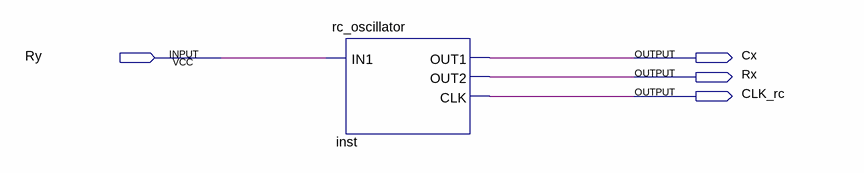
[diagram p0: schematic sheet]
// Quartus schematic RC.bdf as structural Verilog: 1 symbols, 4 pins
module RC (
  input  Ry,
  output Cx,
  output Rx,
  output CLK_rc
);

  rc_oscillator inst (.IN1(Ry), .OUT1(Cx), .OUT2(Rx), .CLK(CLK_rc));
endmodule
